# EAGLE design smart hub v1 (EAGLE 9.6.2)
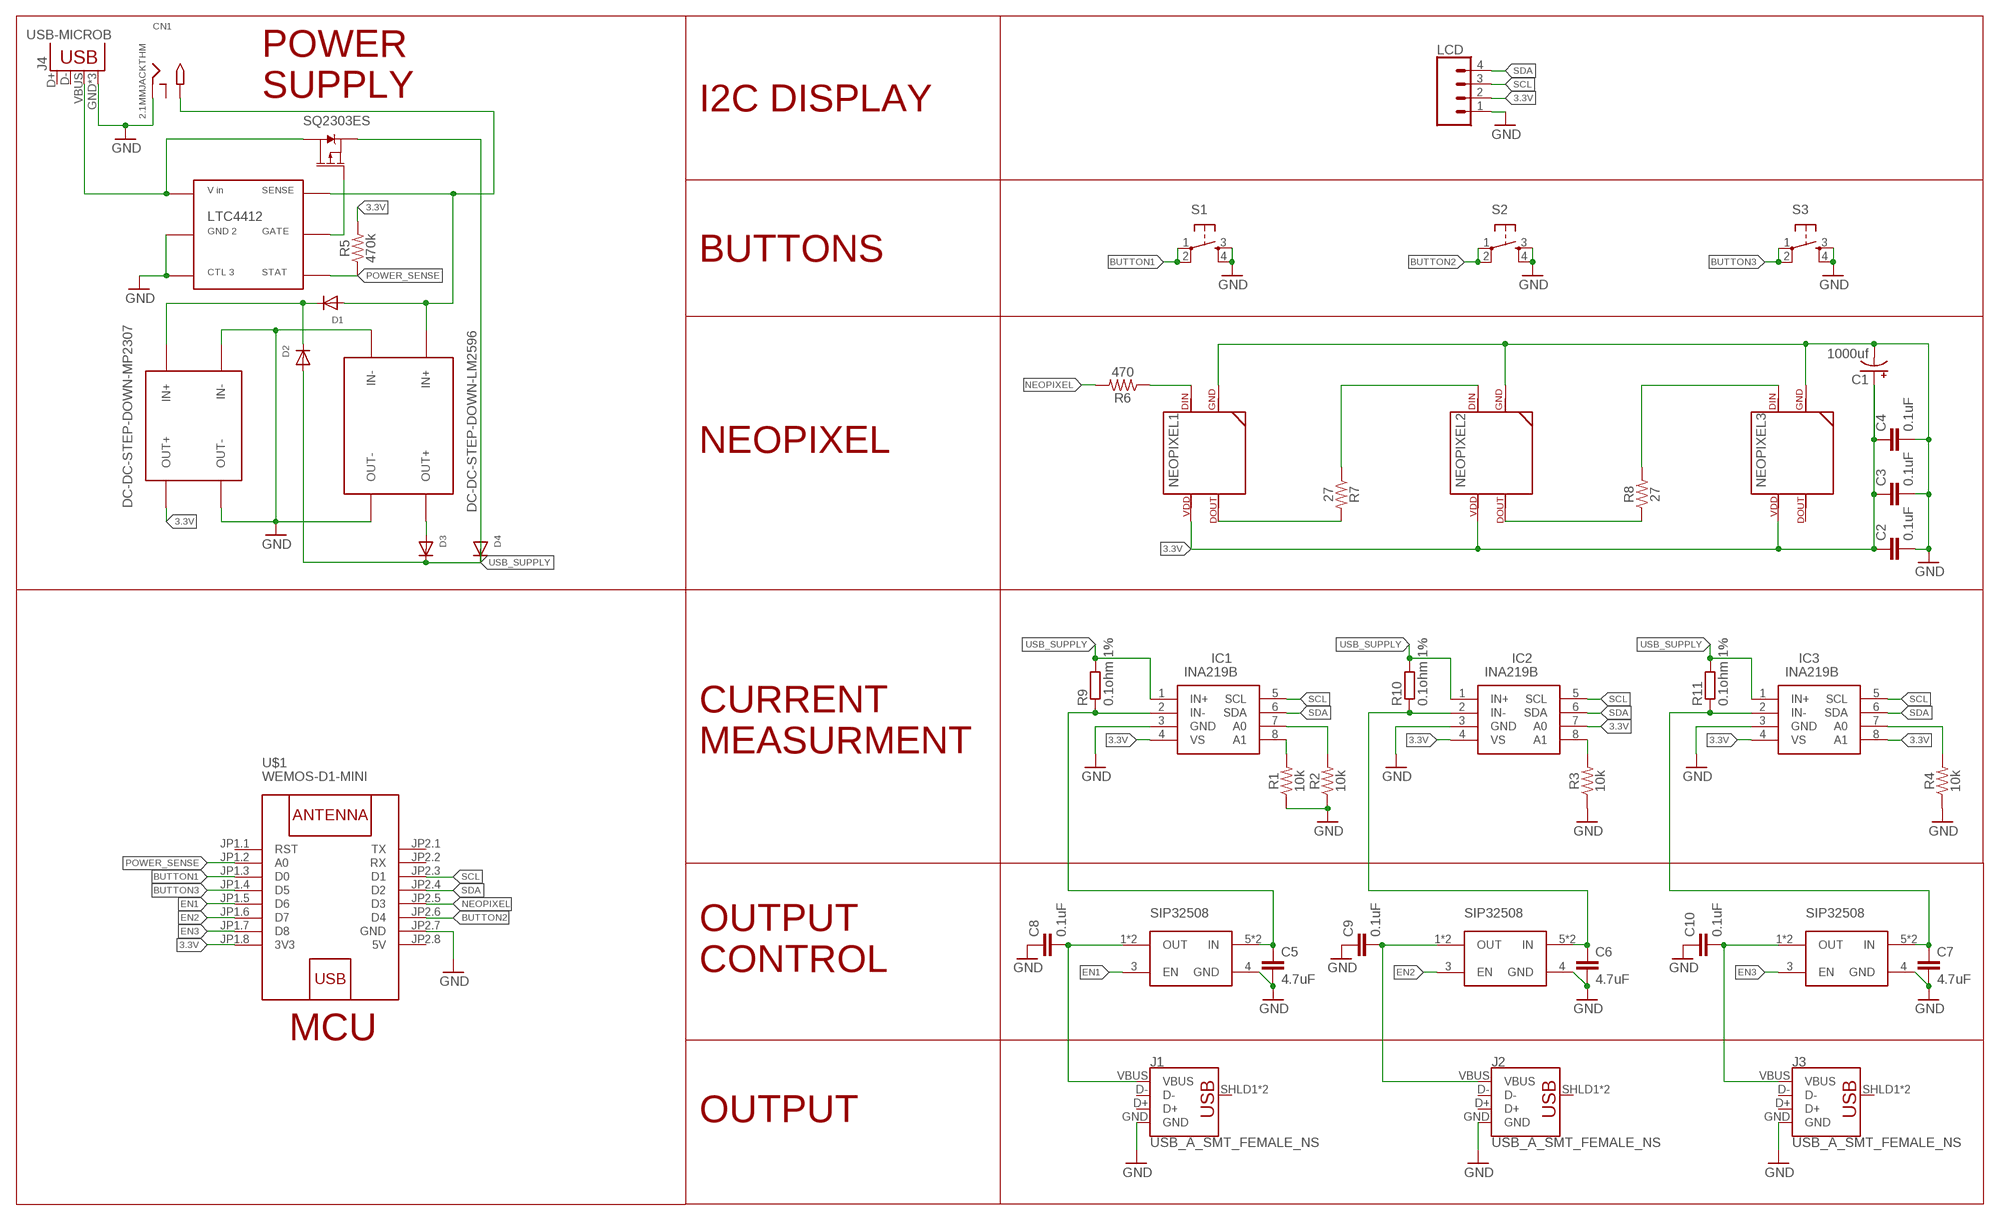
[diagram p0: schematic, sheet 1]

## Parts
C1  1000uf  1000UF-RADIAL-5MM-35V-20%-KIT  [CPOL-RADIAL-5MM-10MM-KIT]
C2  0.1uF  0.1UF-0603-25V-5%  [0603]
C3  0.1uF  0.1UF-0603-25V-5%  [0603]
C4  0.1uF  0.1UF-0603-25V-5%  [0603]
C5  4.7uF  4.7UF-0603-6.3V-(10%)  [0603]
C6  4.7uF  4.7UF-0603-6.3V-(10%)  [0603]
C7  4.7uF  4.7UF-0603-6.3V-(10%)  [0603]
C8  0.1uF  0.1UF-0603-25V-(+80/-20%)  [0603]
C9  0.1uF  0.1UF-0603-25V-(+80/-20%)  [0603]
C10  0.1uF  0.1UF-0603-25V-(+80/-20%)  [0603]
CN1  2.1MMJACKTHM  [PJ-102A]
D1  DIODE_SOD-123FL  [SOD-123FL]
D2  DIODE_SOD-123FL  [SOD-123FL]
D3  DIODE_SOD-123FL  [SOD-123FL]
D4  DIODE_SOD-123FL  [SOD-123FL]
IC1  INA219B  INA219BIDCNT  [SOT65P280X145-8N]
IC2  INA219B  INA219BIDCNT  [SOT65P280X145-8N]
IC3  INA219B  INA219BIDCNT  [SOT65P280X145-8N]
J1  USB_A_SMT_FEMALE_NS  [USB-A-S-NOSILK-FEMALE]
J2  USB_A_SMT_FEMALE_NS  [USB-A-S-NOSILK-FEMALE]
J3  USB_A_SMT_FEMALE_NS  [USB-A-S-NOSILK-FEMALE]
J4  USB-MICROB  [USB-MICROB]
LCD  CONN_04  [1X04]
LTC4412  LTC4412  [TSOT23-6]
NEOPIXEL1  SK6812NEOPIXEL5050  [SK6812]
NEOPIXEL2  SK6812NEOPIXEL5050  [SK6812]
NEOPIXEL3  SK6812NEOPIXEL5050  [SK6812]
R1  10k  10KOHM-0603-1/10W-1%  [0603]
R2  10k  10KOHM-0603-1/10W-1%  [0603]
R3  10k  10KOHM-0603-1/10W-1%  [0603]
R4  10k  10KOHM-0603-1/10W-1%  [0603]
R5  470k  43KOHM-0603-1/10W-1%  [0603]
R6  470  470OHM-0603-1/10W-1%  [0603]
R7  27  470OHM-0603-1/10W-1%  [0603]
R8  27  470OHM-0603-1/10W-1%  [0603]
R9  0.1ohm 1%  R-EU_R1206W  [R1206W]
R10  0.1ohm 1%  R-EU_R1206W  [R1206W]
R11  0.1ohm 1%  R-EU_R1206W  [R1206W]
S1  TAC_SWITCHPTH  [TACTILE-PTH]
S2  TAC_SWITCHPTH  [TACTILE-PTH]
S3  TAC_SWITCHPTH  [TACTILE-PTH]
U$1  WEMOS-D1-MINI  [WEMOS-D1-MINI]
U$2  SQ2303ES  [SOT23]
U$3  SIP32508  [SOT23-6]
U$4  SIP32508  [SOT23-6]
U$5  SIP32508  [SOT23-6]
U$6  DC-DC-STEP-DOWN-LM2596  [DC-DC-STEP-DOWN-LM2596]
U$7  DC-DC-STEP-DOWN-MP2307  [DC-DC-STEP-DOWN-MP2307]

## Nets
3.3V: C1.+ C2.1 C3.1 C4.1 IC1.4(VS) IC2.4(VS) IC2.7(A0) IC3.4(VS) IC3.8(A1) LCD.2 NEOPIXEL1.1(VDD) NEOPIXEL2.1(VDD) NEOPIXEL3.1(VDD) R5.2 U$1.JP1.8(3V3) U$7.OUT+
BUTTON1: S1.1 S1.2 U$1.JP1.3(D0)
BUTTON2: S2.1 S2.2 U$1.JP2.6(D4)
BUTTON3: S3.1 S3.2 U$1.JP1.4(D5)
EN1: U$1.JP1.5(D6) U$3.3(EN)
EN2: U$1.JP1.6(D7) U$4.3(EN)
EN3: U$1.JP1.7(D8) U$5.3(EN)
GND: C1.- C2.2 C3.2 C4.2 C5.2 C6.2 C7.2 C8.1 C9.1 C10.1 CN1.RING IC1.3(GND) IC2.3(GND) IC3.3(GND) J1.GND J2.GND J3.GND J4.GND J4.MT1(GND) J4.MT2(GND) LCD.1 LTC4412.2 LTC4412.3 NEOPIXEL1.3(GND) NEOPIXEL2.3(GND) NEOPIXEL3.3(GND) R1.1 R2.1 R3.1 R4.1 S1.3 S1.4 S2.3 S2.4 S3.3 S3.4 U$1.JP2.7(GND) U$3.4(GND) U$4.4(GND) U$5.4(GND) U$6.IN- U$6.OUT- U$7.IN- U$7.OUT-
N$1: CN1.TIP D1.A LTC4412.6 U$6.IN+
N$2: D1.C D2.C U$7.IN+
N$3: D4.A U$2.2(S)
N$4: D3.A U$6.OUT+
N$5: LTC4412.5 U$2.1(G)
N$6: NEOPIXEL2.4(DIN) R7.1
N$7: J4.VBUS LTC4412.1 U$2.3(D)
N$8: NEOPIXEL3.4(DIN) R8.2
N$9: NEOPIXEL1.2(DOUT) R7.2
N$10: NEOPIXEL2.2(DOUT) R8.1
N$11: C5.1 IC1.2(IN-) R9.1 U$3.5(IN) U$3.6(IN)
N$12: C6.1 IC2.2(IN-) R10.1 U$4.5(IN) U$4.6(IN)
N$13: IC3.7(A0) R4.2
N$14: IC2.8(A1) R3.2
N$15: IC1.8(A1) R1.2
N$16: IC1.7(A0) R2.2
N$17: NEOPIXEL1.4(DIN) R6.1
N$19: C7.1 IC3.2(IN-) R11.1 U$5.5(IN) U$5.6(IN)
N$21: C8.2 J1.VBUS U$3.1(OUT) U$3.2(OUT)
N$22: C9.2 J2.VBUS U$4.1(OUT) U$4.2(OUT)
N$23: C10.2 J3.VBUS U$5.1(OUT) U$5.2(OUT)
NEOPIXEL: R6.2 U$1.JP2.5(D3)
POWER_SENSE: LTC4412.4 R5.1 U$1.JP1.2(A0)
SCL: IC1.5(SCL) IC2.5(SCL) IC3.5(SCL) LCD.3 U$1.JP2.3(D1)
SDA: IC1.6(SDA) IC2.6(SDA) IC3.6(SDA) LCD.4 U$1.JP2.4(D2)
USB_SUPPLY: D2.A D3.C D4.C IC1.1(IN+) IC2.1(IN+) IC3.1(IN+) R9.2 R10.2 R11.2
Unconnected: CN1.RING_SW J1.D+ J1.D- J1.SHLD1(SHIELD) J1.SHLD2(SHIELD) J2.D+ J2.D- J2.SHLD1(SHIELD) J2.SHLD2(SHIELD) J3.D+ J3.D- J3.SHLD1(SHIELD) J3.SHLD2(SHIELD) J4.D+ J4.D- NEOPIXEL3.2(DOUT) U$1.JP1.1(RST) U$1.JP2.1(TX) U$1.JP2.2(RX)

## Notes on the sheet
- POWER
  SUPPLY
- I2C DISPLAY
- LTC4412
- BUTTONS
- NEOPIXEL
- CURRENT
  MEASURMENT
- OUTPUT
  CONTROL
- MCU
- OUTPUT

## Power pins joined to a net without a drawn wire
5V: U$1.JP2.8(5V)

## Library data of the parts
C1 = SparkFun-Capacitors:1000UF: 1,000µF/1mF ceramic capacitors A capacitor is a passive two-terminal electrical component used to store electrical energy temporarily in an electric field. CAP-08070; PROD_ID: CAP-09538; VALUE: 1mf
C2-C4 = SparkFun-Capacitors:0.1UF: 0.1µF ceramic capacitors A capacitor is a passive two-terminal electrical component used to store electrical energy temporarily in an electric field.; PROD_ID: CAP-08604
C5-C7 = SparkFun-Capacitors:4.7UF: 4.7µF ceramic capacitors A capacitor is a passive two-terminal electrical component used to store electrical energy temporarily in an electric field.; PROD_ID: CAP-08280
C8-C10 = SparkFun-Capacitors:0.1UF: 0.1µF ceramic capacitors A capacitor is a passive two-terminal electrical component used to store electrical energy temporarily in an electric field.; PROD_ID: CAP-00810
CN1 = adafruit:2.1MMJACK: 2.1mm x 5.5mm THM DC jack with internal switch. Digikey part #PJ-102A, 4UCON part #05537 2.1mm x 5.5mm SMT DC jack with internal switch. Digikey part #PJ-002A-SMT, 4UCON part #03267 By microbuilder.eu & adafruit.com
D1-D4 = adafruit:DIODE: Diode SMADIODE - SMA Surface Mount Package 20V 1A Schottky Diode Digikey: 641-1014-6-ND DO-1N4148 - Through Hole Small Current Diode SOD-123 20V 1 A (.5mV Vf) Schottky Diode - Digikey: MBRX120TPMSCT-ND SOD-323 10V 570mA (.38mV Vf, 3ns) Schottky Diode - Digikey: ZLLS410CT-ND SOD-523 30V 30mA Schottky Diode (RB751S-40TE61) - Digikey: RB751S-40TE61CT-ND SOT23-R/W - SOT23 Package (R = Solder Paste/Reflow Ovens, W = Hand-Soldering) BAT54Film 40V 300mA - Digikey: 497-7162-1-ND
IC1-IC3 = INA219BIDCNT:INA219BIDCNT: INA219BIDCNT, Intelligent Power Switch High Side Current Shunt, Power Monitor, 0.01A, 5.5V, 8-Pin, SOT-23 Source: Datasheet <http://www.ti.com/lit/ds/symlink/ina219.pdf>; ARROW_PART_NUMBER: INA219BIDCNT; ARROW_PRICE-STOCK: https://www.arrow.com/en/products/ina219bidcnt/texas-instruments; DESCRIPTION: INA219BIDCNT, Intelligent Power Switch High Side Current Shunt, Power Monitor, 0.01A, 5.5V, 8-Pin, SOT-23; HEIGHT: 1.45mm; MANUFACTURER_NAME: Texas Instruments; MANUFACTURER_PART_NUMBER: INA219BIDCNT; MOUSER_PART_NUMBER: 595-INA219BIDCNT; MOUSER_PRICE-STOCK: https://www.mouser.co.uk/ProductDetail/Texas-Instruments/INA219BIDCNT?qs=1WmUhT%2FVMIMmEKxVjzYikA%3D%3D
J1-J3 = SparkFun-Connectors:USB_A: USB-A Connector Male and female variants, as well as PTH and SMT variants SparkFun Products: SparkFun XBee Explorer Dongle <https://www.sparkfun.com/products/11697> PTH Male SparkFun MicroView-USB Programmer <https://www.sparkfun.com/products/12924> SMT Male SparkFun USB Type A Female Breakout <https://www.sparkfun.com/products/12700> SMT Female; PROD_ID: CONN-09520; SF_ID: PRT-09011
J4 = SparkFun-Retired:USB: USB Connectors USB-B-PTH is fully proven SKU : PRT-00139/CONN-08278 USB-miniB is fully proven SKU : PRT-00587 USB-A-PCB is untested. USB-A-H is throughly reviewed, but untested. Spark Fun Electronics SKU : PRT-00437 USB-B-SMT is throughly reviewed, but untested. Needs silkscreen touching up. USB-A-S has not been used/tested USB-MB-H has not been used/tested USB-MICROB has been used. CONN-09505; PROD_ID: CONN-09505
LCD = SparkFun-Connectors:CONN_04: Multi connection point. Often used as Generic Header-pin footprint for 0.1 inch spaced/style header connections On any of the 0.1 inch spaced packages, you can populate with these: Break Away Headers - Straight <https://www.sparkfun.com/products/116> (PRT-00116) Break Away Male Headers - Right Angle <https://www.sparkfun.com/products/553> (PRT-00553) Female Headers <https://www.sparkfun.com/products/115> (PRT-00115) Break Away Headers - Machine Pin <https://www.sparkfun.com/products/117> (PRT-00117) Break Away Female Headers - Swiss Machine Pin <https://www.sparkfun.com/products/743> (PRT-00743) For SCREWTERMINALS and SPRING TERMINALS visit here: Screw Terimnals on SparkFun.com <https://www.sparkfun.com/search/results?term=Screw+Terminals> (5mm/3.5mm/2.54mm spacing) This device is also useful as a general connection point to wire up your design to another part of your project. Our various solder wires solder well into these plated through hole pads. Hook-Up Wire - Assortment (Stranded, 22 AWG) <https://www.sparkfun.com/products/11375> (PRT-11375) Hook-Up Wire - Assortment (Solid Core, 22 AWG) <https://www.sparkfun.com/products/11367> (PRT-11367) View the entire wire category on our website here <https://www.sparkfun.com/categories/141> Special notes: Molex polarized connector foot print use with SKU : PRT-08231 with associated crimp pins and housings. 1MM SMD Version SKU: PRT-10208; PROD_ID: CONN-09696
LTC4412 = custom parts:LTC4412: power switch over
NEOPIXEL1-NEOPIXEL3 = custom parts:SK6812: for 5050 sk6812 LED
R1-R4 = SparkFun-Resistors:10KOHM: 10kΩ resistor A resistor is a passive two-terminal electrical component that implements electrical resistance as a circuit element. Resistors act to reduce current flow, and, at the same time, act to lower voltage levels within circuits. - Wikipedia; PROD_ID: RES-00824
R5 = SparkFun-Resistors:43KOHM: 43kΩ resistor A resistor is a passive two-terminal electrical component that implements electrical resistance as a circuit element. Resistors act to reduce current flow, and, at the same time, act to lower voltage levels within circuits. - Wikipedia; PROD_ID: RES-07858; VALUE: 43k
R6 = SparkFun-Resistors:470OHM: 470Ω resistor A resistor is a passive two-terminal electrical component that implements electrical resistance as a circuit element. Resistors act to reduce current flow, and, at the same time, act to lower voltage levels within circuits. - Wikipedia; PROD_ID: RES-07869
R7 R8 = SparkFun-Resistors:470OHM: 470Ω resistor A resistor is a passive two-terminal electrical component that implements electrical resistance as a circuit element. Resistors act to reduce current flow, and, at the same time, act to lower voltage levels within circuits. - Wikipedia; PROD_ID: RES-07869; VALUE: 470
R9-R11 = resistor:R-EU_: RESISTOR, European symbol
S1-S3 = SparkFun-Retired:TAC_SWITCH: Momentary Switch Button commonly used for reset or general input. Spark Fun Electronics SKU : COM-00097 SMT- SWCH-08247
U$1 = diy-modules:WEMOS-D1-MINI: WEMOS D1 mini: Mini Wi-Fi Board based on ESP-8266 device More details can be found here: https://www.wemos.cc/product/d1-mini.html Click here to find device on ebay.com <http://www.ebay.com/sch/wemos+d1+mini+nodemcu>
U$2 = custom parts:SQ2303ES: P-Channel Mosfet
U$3-U$5 = custom parts:SIP32508: SiP32508 high side driver, 5v 3A
U$6 = diy-modules:DC-DC-STEP-DOWN-LM2596: DC/DC Step-Down Regulator based on LM2596-ADJ chip LM2596 datasheet available here: http://www.ti.com/lit/ds/symlink/lm2596.pdf Click here to find device on ebay.com <http://www.ebay.com/sch/lm2596+power+regulator>
U$7 = diy-modules:DC-DC-STEP-DOWN-MP2307: DC/DC Step-Down Regulator based on MP2307DN chip MP2307 datasheet available here: https://cdn-shop.adafruit.com/datasheets/MP2307_r1.9.pdf Click here to find device on ebay.com <http://www.ebay.com/sch/dc+dc+3a+mini+converter>

## Board
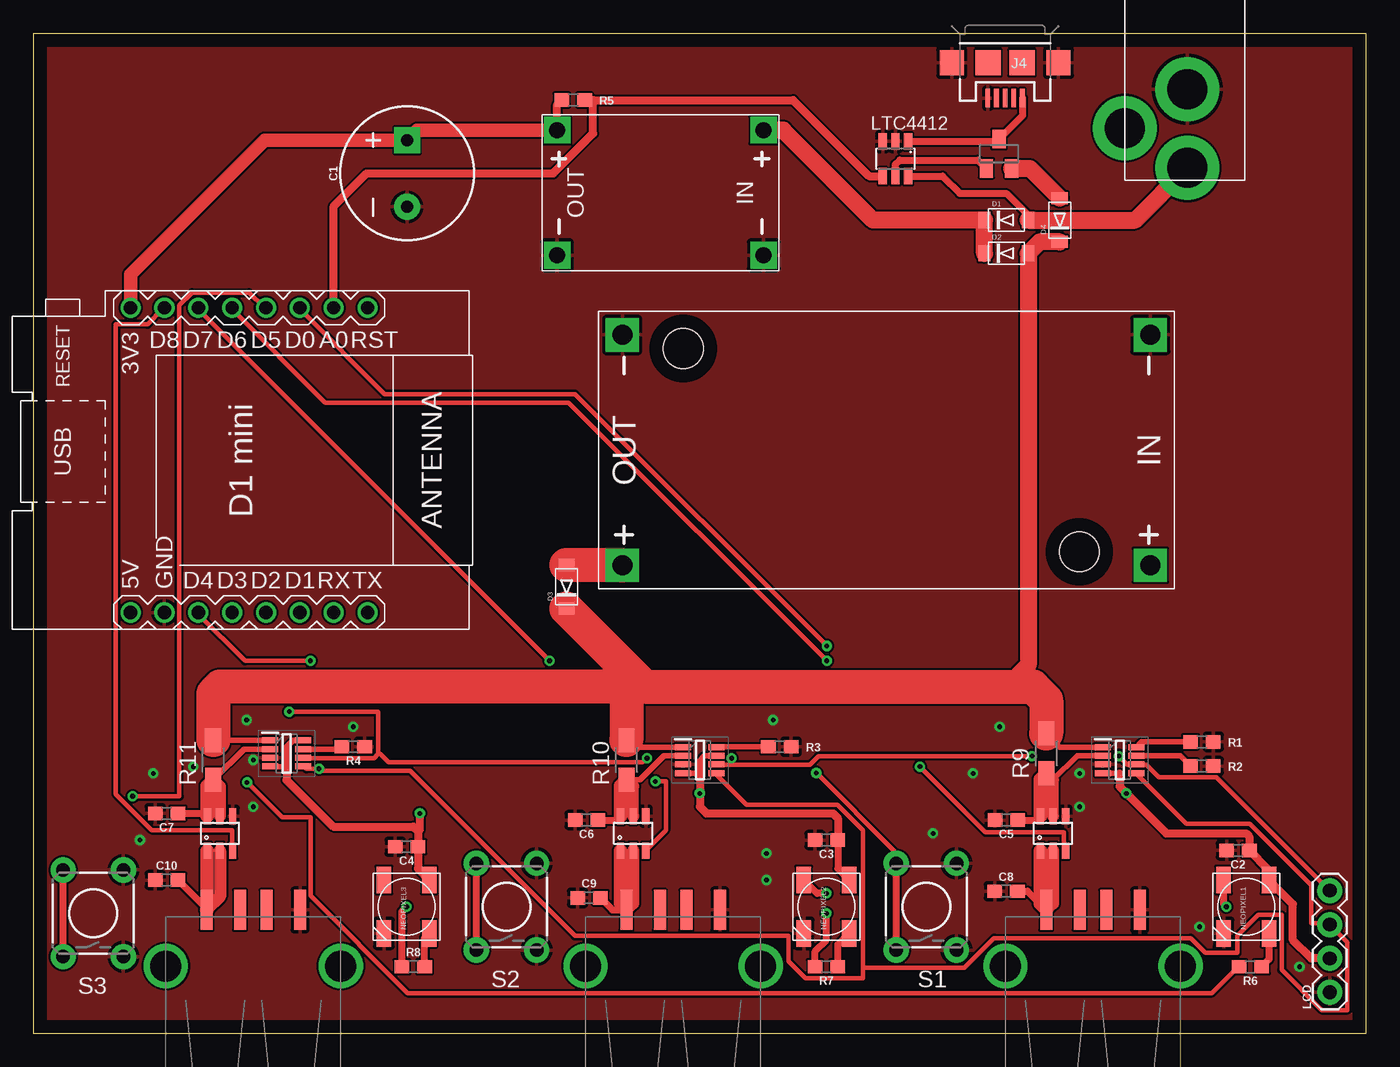
[diagram p1: board, top side]
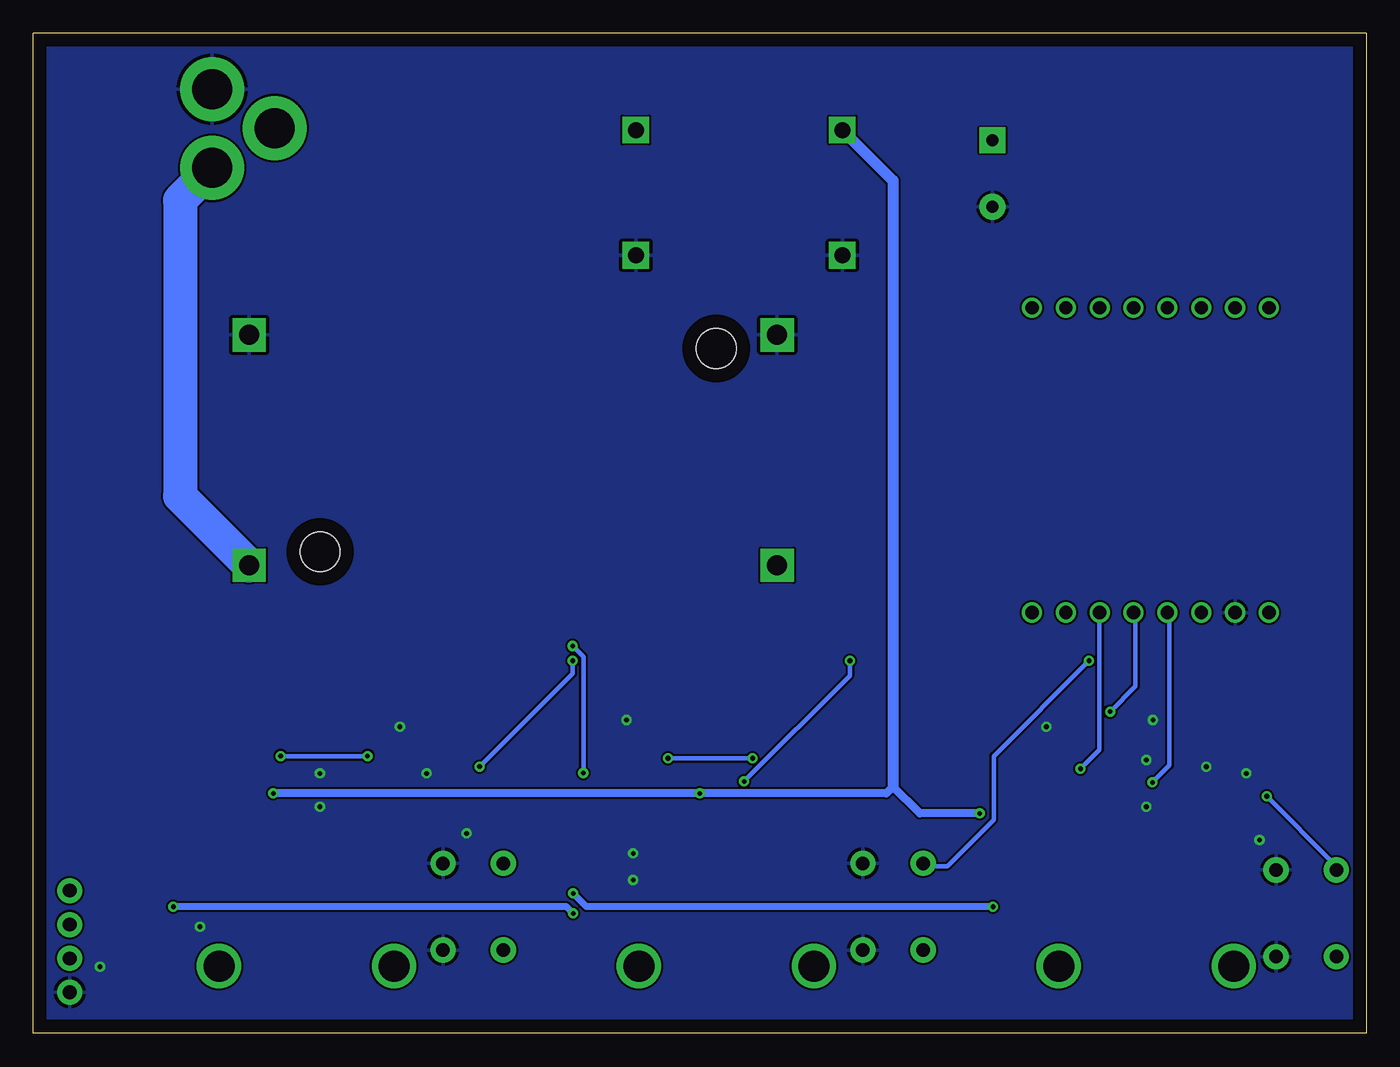
[diagram p2: board, bottom side, seen from below]

Size 100 x 75 mm. Coordinates in mm from the lower left corner, seen from the top.
Outline: 0,0 100,0 100,75 0,75 0,0
Copper layers (1*16): Top 0.035mm / dielectric 1.5mm / Bottom 0.035mm
Design rules "default *": minimum track width 6mil, minimum drill 0.35mm, track to track 6mil, track to pad 6mil, pad to pad 6mil, via to via 6mil, smd to smd 6mil, copper to edge 40mil, drill to drill 6mil, minimum pad ring 10mil, minimum via ring 8mil, stop-mask expansion 4mil, vias tented up to drill 0mil, thermal gap 10mil

### Footprints (pad centres in the part's own frame; a part is rotated, then mirrored left to right if it is on the bottom)
CPOL-RADIAL-5MM-10MM-KIT = drill 0.9 pad 1.93 square: + 2.5,0 | drill 0.9 pad 1.93: - -2.5,0
0603 = smd 1.1 x 1: 1 -0.85,0; 2 0.85,0
PJ-102A = drill 3 pad 4.8: RING 0.1,-3.39; RING_SW -4.6,-6.29; TIP 0.1,-9.29
SOD-123FL = smd 0.91 x 1.22: A 1.637,0; C -1.637,0
SOT65P280X145-8N = smd 1.2 x 0.45: 1 -1.25,0.975; 2 -1.25,0.325; 3 -1.25,-0.325; 4 -1.25,-0.975; 5 1.25,-0.975; 6 1.25,-0.325; 7 1.25,0.325; 8 1.25,0.975
USB-A-S-NOSILK-FEMALE = smd 3 x 0.9: D+ 6.752,-1; D- 6.752,1; GND 6.752,-3.5; VBUS 6.752,3.5 | drill 2.311: SHLD1 2.54,-6.566; SHLD2 2.54,6.566
USB-MICROB = smd 0.35 x 1.4: D+ 0,2.65; D- -0.65,2.65; GND 1.3,2.65; ID 0.65,2.65; VBUS -1.3,2.65 | smd 1.8 x 1.9: MT1 -4,0; MT2 4,0 | smd 1.9 x 1.9: P$1 -1.27,0; P$2 1.27,0
1X04 = drill 1.016 pad 1.88: 1 0,0; 2 2.54,0; 3 5.08,0; 4 7.62,0
TSOT23-6 = smd 0.62 x 1.22: 1 -0.95,-1.3; 2 0,-1.3; 3 0.95,-1.3; 4 0.95,1.3; 5 0,1.3; 6 -0.95,1.3
SK6812 = smd 2 x 1.1: 1 -2,1.7; 2 -2,-1.7; 3 2,-1.7; 4 2,1.7
R1206W = smd 1.8 x 1.2: 1 -1.499,0; 2 1.499,0
TACTILE-PTH = drill 1.016 pad 1.88: 1 -3.251,2.261; 2 3.251,2.261; 3 -3.251,-2.261; 4 3.251,-2.261
WEMOS-D1-MINI = drill 1: JP1.1 -11.43,9.525; JP1.2 -11.43,6.985; JP1.3 -11.43,4.445; JP1.4 -11.43,1.905; JP1.5 -11.43,-0.635; JP1.6 -11.43,-3.175; JP1.7 -11.43,-5.715; JP1.8 -11.43,-8.255; JP2.1 11.43,9.525; JP2.2 11.43,6.985; JP2.3 11.43,4.445; JP2.4 11.43,1.905; JP2.5 11.43,-0.635; JP2.6 11.43,-3.175; JP2.7 11.43,-5.715; JP2.8 11.43,-8.255
SOT23 = smd 1 x 1.4: 1 -0.95,-1.1; 2 0.95,-1.1; 3 0,1.1
SOT23-6 = smd 0.55 x 1.2: 1 -0.95,-1.3; 2 0,-1.3; 3 0.95,-1.3; 4 0.95,1.3; 5 0,1.3; 6 -0.95,1.3
DC-DC-STEP-DOWN-LM2596 = drill 1.5 pad 2.5 square: IN+ -19.812,8.636; IN- -19.812,-8.636; OUT+ 19.812,8.636; OUT- 19.812,-8.636 | hole 3: -14.478,7.62; 15.24,-7.62
DC-DC-STEP-DOWN-MP2307 = drill 1.2 pad 2 square: IN+ -7.747,-4.699; IN- -7.747,4.699; OUT+ 7.747,-4.699; OUT- 7.747,4.699

### Placement (x,y rotation side)
C1  28.04,64.49 90 top
C2  90.38,13.72 180 top
C3  59.5,14.5 180 top
C4  28,14 180 top
C5  73,16 180 top
C6  41.5,16 180 top
C7  10,16.5 180 top
C8  72.98,10.66 0 top
C9  41.69,10.16 0 top
C10  10,11.5 0 top
CN1  86.48,74.19 0 top
D1  73,61 0 top
D2  73,58.5 0 top
D3  40,33.5 90 top
D4  77,61 90 top
IC1  81.5,20.5 0 top
IC2  50,20.5 0 top
IC3  19,21 0 top
J1  79.5,2.5 90 top
J2  48,2.5 90 top
J3  16.5,2.5 90 top
J4  72.91,72.79 180 top
LCD  97.27,3.08 90 top
LTC4412  64.68,65.59 180 top
NEOPIXEL1  91,9.5 270 top
NEOPIXEL2  59.5,9.5 270 top
NEOPIXEL3  28,9.5 270 top
R1  87.67,21.86 180 top
R2  87.67,20.05 180 top
R3  56,21.5 180 top
R4  24,21.5 180 top
R5  40.5,70 180 top
R6  91.3,4.99 180 top
R7  59.5,5 180 top
R8  28.5,5 0 top
R9  76,21 90 top
R10  44.5,20.5 90 top
R11  13.5,20.5 90 top
S1  67,9.5 90 top
S2  35.5,9.5 90 top
S3  4.5,9 90 top
U$1  15.55,42.99 270 top
U$2  72.45,65.97 0 top
U$3  76.5,15 0 top
U$4  45,15 0 top
U$5  14,15 0 top
U$6  64,43.74 180 top
U$7  47.05,63.05 180 top

### Tracks (layer width: path | path; a pad name or v marks a point on that pad's centre or on a via)
3.3V  (via drill 0.35)
  Top 0.406: IC2.7 50.33,20.82 50,20.5 50,19.5 48.77,19.5 IC2.4 | IC3.8 19.48,21.98 19,21.5 19,20 17.77,20 IC3.4 | IC1.4 80.28,19.5 81.5,19.5
  Top 0.508: C3.1 60.35,12.35 NEOPIXEL2.1 | NEOPIXEL1.1 92.7,12.25
  Top 0.61: U$7.OUT+ 39.3,69.65 R5.2 | 92.7,12.25 C2.1 91.23,14.77 91,15 85,15 v82,18 81.5,18.5 81.5,19.5 | LCD.2 95.88,5.62 94.5,7 94.5,9.7 NEOPIXEL1.1 | NEOPIXEL3.1 28.85,12.35 C4.1 28.85,15.15 | 19,20 19,19 22.5,15.5 28.5,15.5 28.85,15.15 | 50,19.5 v50,18 50,17 50.5,16.5 60,16.5 60.35,16.15 C3.1 | 28.85,15.15 29,15.3 v29,16.5
  Top 1.016: U$7.OUT+ 28.8,67.75 C1.+ 17.36,66.99 7.29,56.92 U$1.JP1.8
  Bottom 0.61: v29,16.5 33.5,16.5 35.5,18.5 36,18 v50,18 v82,18
  Bottom 0.813: U$7.OUT+ 35.5,63.95 35.5,18.5
BUTTON1  (via drill 0.35)
  Top 0.356: v59.53,29.05 40.64,47.94 26.35,47.94 20,54.29 U$1.JP1.3 | v58.74,19.53 64.61,13.65 64.61,12.86 S1.2
  Top 0.508: S1.1 S1.2
  Bottom 0.356: v59.53,29.05 58.74,28.26 v58.74,19.53
BUTTON2  (via drill 0.35)
  Top 0.356: v20.8,27.94 15.88,27.94 12.38,31.43 U$1.JP2.6
  Top 0.508: S2.1 S2.2
  Bottom 0.356: v20.8,27.94 27.94,20.8 27.94,16.03 31.43,12.54 33.18,12.54 33.18,12.7 S2.2
BUTTON3  (via drill 0.35)
  Top 0.356: v7.46,17.78 10.95,17.78 10.95,54.61 11.91,55.56 16.19,55.56 17.3,54.45 U$1.JP1.4
  Top 0.508: S3.1 S3.2
  Bottom 0.356: v7.46,17.78 2.38,12.7 2.38,12.38 S3.2
EN1  (via drill 0.35)
  Top 0.356: v66.52,20 71.44,15.08 77.31,15.08 77.31,13.81 U$3.3 | v59.53,27.94 40.16,47.31 21.91,47.31 14.92,54.29 U$1.JP1.5
  Bottom 0.356: v66.52,20 59.53,26.99 v59.53,27.94
EN2  (via drill 0.35)
  Top 0.356: v46.67,18.89 47.47,18.89 47.47,15.24 46.04,13.81 U$4.3 | v38.73,27.94 12.38,54.29 U$1.JP1.6
  Bottom 0.356: v46.67,18.89 38.73,26.83 v38.73,27.94
EN3
  Top 0.356: U$5.3 14.92,13.81 14.92,15.24 8.89,15.24 6.19,17.94 6.19,53.18 8.57,53.18 9.68,54.29 U$1.JP1.7
GND  (via drill 0.35)
  other vias: 55,13.5 55,11.5 55.5,23.5 67.5,15 70.5,19.5 16.5,17 8,14.5 12,20 16.5,20.5 78.5,19.5 78.5,17 24,23 16,23.5 72.5,23 87.5,8 95,5 9,19.5
  pour Top: 100,75 0,75 0,0 100,0
  pour Bottom: 100,75 0,75 0,0 100,0
N$1
  Top 0.508: LTC4412.6 68.21,64.29 69.5,63 73,63 74.64,61.36 D1.A
  Top 1.27: CN1.TIP 82.68,61 D1.A
  Bottom 2.54: CN1.TIP 89,62.48 89,40.29 U$6.IN+
N$2
  Top 1.27: D2.C D1.C 63,61 56.25,67.75 U$7.IN+
N$3
  Top 1.27: U$2.2 74.77,64.87 D4.A
N$4
  Top 2.54: D3.A 44.15,35.14 U$6.OUT+
N$5
  Top 0.508: LTC4412.5 64.68,65.18 65,65.5 70.87,65.5 U$2.1
N$6
  Top 0.508: R7.1 60.35,6.65 NEOPIXEL2.4
N$7
  Top 0.508: J4.VBUS 74.21,68.83 U$2.3 72.27,66.89 LTC4412.1
N$8
  Top 0.508: R8.2 29.35,7.15 NEOPIXEL3.4
N$9  (via drill 0.35)
  Top 0.508: R7.2 58.65,6.15 59.5,7 v59.5,9 | v89.5,9.5 89.3,9.7 NEOPIXEL1.2
  Bottom 0.508: v59.5,9 60,9.5 v89.5,9.5
N$10  (via drill 0.35)
  Top 0.508: R8.1 27.65,9.15 v28,9.5 | v59.5,10.5 58.8,10.5 NEOPIXEL2.2
  Bottom 0.508: v28,9.5 58.5,9.5 v59.5,10.5
N$11
  Top 0.406: IC1.2 78.32,20.82 76.5,19
  Top 0.508: C5.1 75.25,16 U$3.6
  Top 0.889: R9.1 76.5,19 U$3.5
  Top 1.016: U$3.6 75.55,19.05 R9.1
N$12
  Top 0.406: IC2.2 47.33,20.82 45.5,19 R10.1
  Top 0.508: C6.1 43.75,16 U$4.6
  Top 0.889: R10.1 45,18.5 U$4.5
  Top 1.016: U$4.6 44.05,18.55 R10.1
N$13
  Top 0.406: IC3.7 22.98,21.32 R4.2
N$14
  Top 0.406: IC2.8 51.27,21.5 R3.2
N$15
  Top 0.406: IC1.8 83.14,21.86 R1.2
N$16
  Top 0.406: IC1.7 86.05,20.82 R2.2
N$17
  Top 0.508: NEOPIXEL1.4 92.7,5.54 R6.1
N$19
  Top 0.406: IC3.2 15.82,21.32 R11.1
  Top 0.508: C7.1 12.85,16.5 U$5.6
  Top 0.889: R11.1 14,18.5 U$5.5
  Top 1.016: U$5.6 13.05,18.55 R11.1
N$21
  Top 0.508: C8.2 74.59,10.66 J1.VBUS
  Top 0.889: U$3.2 76.5,9.75 J1.VBUS
  Top 1.016: U$3.1 75.55,9.7 J1.VBUS
N$22
  Top 0.508: C9.2 43.45,9.25 J2.VBUS
  Top 0.889: U$4.2 45,9.75 J2.VBUS
  Top 1.016: U$4.1 44.05,9.7 J2.VBUS
N$23
  Top 0.508: C10.2 13,9.35 J3.VBUS
  Top 0.889: U$5.2 14,10.25 13.05,9.3
  Top 1.016: U$5.1 13.05,9.3 J3.VBUS
NEOPIXEL  (via drill 0.35)
  Top 0.356: v16.03,18.82 18.66,16.19 20.8,16.19 20.8,10.32 28.1,3.02 88.42,3.02 90.33,4.92 R6.2
  Bottom 0.356: v16.03,18.82 14.76,20.09 14.76,31.43 U$1.JP2.5
POWER_SENSE
  Top 0.61: R5.1 42,70 | 42,70 57,70 62.71,64.29 LTC4412.4 | 42,70 42,67.5 39,64.5 25,64.5 22.54,62.03 U$1.JP1.2
SCL  (via drill 0.35)
  Top 0.356: IC1.5 82.87,19.37 86.52,15.72 91.28,15.72 95.89,11.11 95.89,8.26 97.16,8.26 LCD.3 97.31,8.1 98.58,6.83 98.58,1.75 96.68,1.75 93.66,4.76 93.66,8.89 91.92,8.89 90.33,7.3 90.33,6.03 87.95,6.03 86.84,7.14 72.07,7.14 69.85,4.92 62.23,4.92 | IC3.5 20.32,20 20.48,19.84 v21.43,19.84 21.43,19.68 28.26,19.68 40.64,7.3 56.67,7.3 56.67,5.4 57.94,4.13 62.23,4.13 62.23,4.92 | 62.23,4.92 62.23,15.24 60.33,17.14 53.5,17.14 51.28,19.37 IC2.5
  Bottom 0.356: v21.43,19.84 20,21.27 20,31.43 U$1.JP2.3
SDA  (via drill 0.35)
  Top 0.356: 25.88,20.95 25.56,20.64 20.32,20.64 IC3.6 | 25.88,20.95 25.88,24.13 v19.21,24.13 | 52.39,20.16 58.26,20.16 58.9,20.8 v74.93,20.8 | 52.39,20.16 51.28,20.16 IC2.6 | v81.44,20.8 82.07,20.16 82.71,20.16 IC1.6 82.87,20.16 83.5,20.16 84.45,19.21 88.74,19.21 97.16,10.79 LCD.4 | v46.04,20.64 45.72,20.32 26.67,20.32 26.04,20.95 25.88,20.95 | 52.39,20.16 v52.39,20.64
  Bottom 0.356: v19.21,24.13 17.3,26.04 17.3,31.43 U$1.JP2.4 | v81.44,20.8 v74.93,20.8 | v52.39,20.64 v46.04,20.64
USB_SUPPLY
  Top 0.406: IC2.1 45.02,21.48 R10.2 | IC1.1 77.02,21.48 R9.2 | R11.2 17.73,22 IC3.1
  Top 1.27: 75,26 74,27 74.64,27.64 D2.A 75.5,59.36 D4.C
  Top 2.54: D3.C 44.5,27.36 | 44.5,27.36 R10.2 | 44.5,27.36 43.14,26 14,26 13.5,25.5 R11.2 | 44.5,27.36 45.86,26 75,26 76,25 R9.2